# EAGLE schematic riffle-CTL-0.2-blank (EAGLE 6.2)
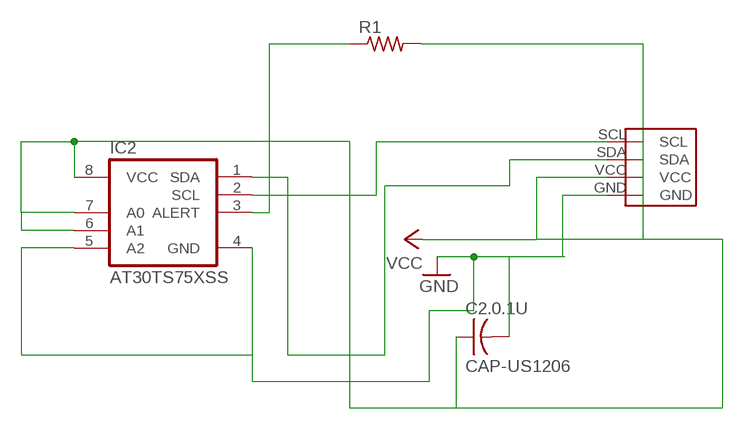
[diagram p0: schematic, sheet 1]

## Parts
C2.0.1U  CAP-US1206  [C1206]
IC2  AT30TS75XSS  [SO8]
R1  RES-US1206  [R1206]
U$3  4PINHEADERTHROUGHHOLE  [1X04THROUGHHOLE]

## Nets
D2: IC2.3(ALERT) R1.1
GND: C2.0.1U.2 IC2.4(GND) IC2.5(A2) U$3.GND
N$4: IC2.2(SCL) U$3.SCL
SDA: IC2.1(SDA) U$3.SDA
VCC: C2.0.1U.1 IC2.6(A1) IC2.7(A0) IC2.8(VCC) R1.2 U$3.VCC

## Library data of the parts
C2.0.1U = fab:CAP-US
IC2 = atmel-at30ts75x:AT30TS75X: The Atmel® AT30TSE750A/AT30TSE752A/754A/758A are a complete, precise temperature monitoring device designed for use in a variety of applications that require the measuring of local temperatures as an integral part of the system's function and/or reliability. The AT30TSE752A/754A/758A devices combine a high-precision digital temperature sensor, programmable high and low temperature alarms, and a 2-wire I2C and SMBus (System Management Bus) compatible serial interface into a single, compact package. The temperature sensor can measure temperatures over the full -55C to +125C temperature range and has a typical accuracy as precise as ±0.5C from 0C to +85C. The result of the digitized temperature measurements are stored in one of the AT30TS75xA internal registers, which is readable at any time through the device's serial interface. X=0 no EEPROM; 2--2 kb; 4 --4 kb; 8 --8 kb The library has been designed by Richard Magdycz <https://www.facebook.com/groups/eaglecadsoftUK>
R1 = fab:RES-US: Resistor (US Symbol) Variants with postfix FAB are widened to allow the routing of internal traces
U$3 = tempSensor:4PINHEADERTHROUGHHOLE

## Net classes
0 default: width 0.203 mm, drill 0.33 mm, clearance 0.203 mm